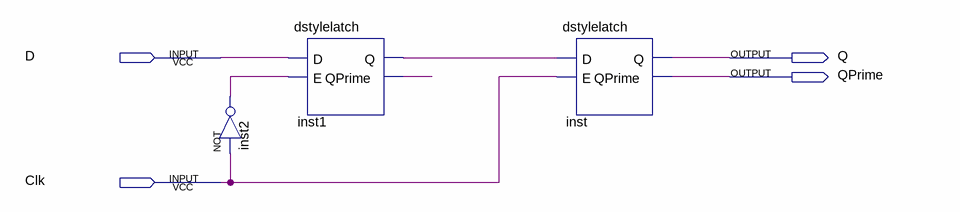
[diagram p0: schematic sheet]
// Quartus schematic dflipflop.bdf as structural Verilog: 3 symbols, 4 pins
module dflipflop (
  input  D,
  input  Clk,
  output Q,
  output QPrime
);

  wire inst1_q, inst1_qprime, inst2_out;

  not inst2 (inst2_out, Clk);
  dstylelatch inst1 (.D(D), .E(inst2_out), .Q(inst1_q), .QPrime(inst1_qprime));
  dstylelatch inst (.D(inst1_q), .E(Clk), .Q(Q), .QPrime(QPrime));
endmodule
